# Altium schematic sheet Power.SchDoc
size A3
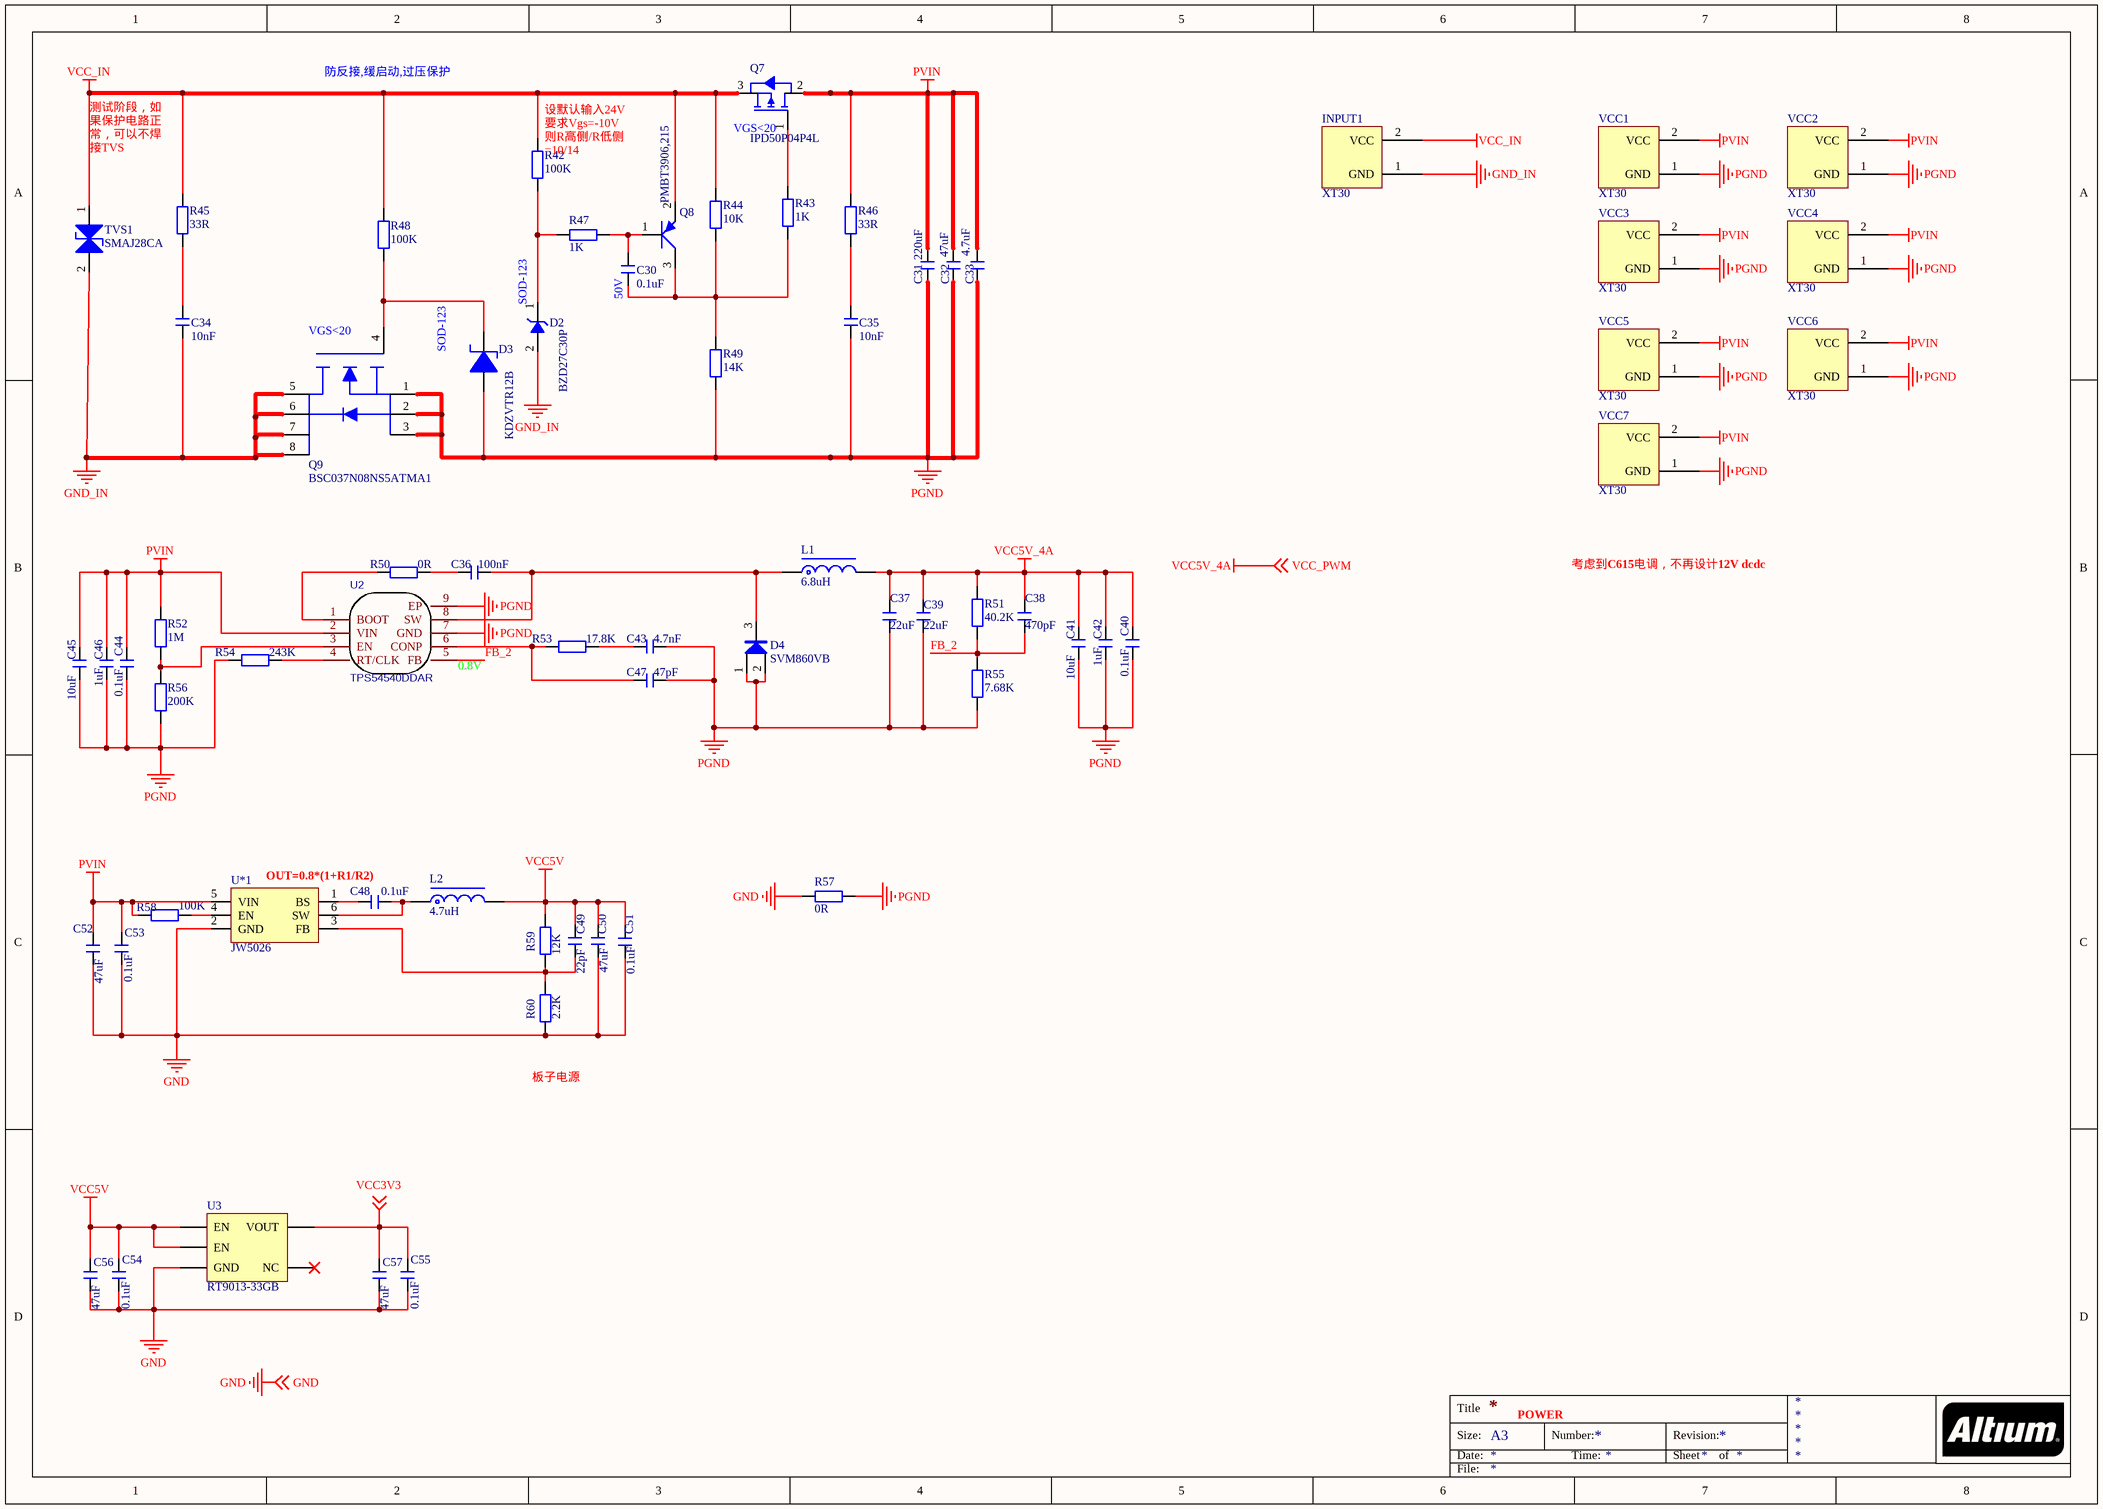
[diagram p0: Power.SchDoc]

## Parts
C30  0.1uF  [C 0603_L]
C31  220uF  [C 1206_L]
C32  47uF  [C 1206_L]
C33  4.7uF  [C 1206_L]
C34  10nF  [C 0603_L]
C35  10nF  [C 0603_L]
C36  100nF  [C 0603_L]
C37  22uF  [C 0805_L]
C38  470pF  [C 0603_L]
C39  22uF  [C 0805_L]
C40  0.1uF  [C 0805_L]
C41  10uF  [C 0805_L]
C42  1uF  [C 0805_L]
C43  4.7nF  [C 0603_L]
C44  0.1uF  [C 0805_L]
C45  10uF  [C 0805_L]
C46  1uF  [C 0805_L]
C47  47pF  [C 0603_L]
C48  0.1uF  [C 0603_L]
C49  22pF  [C 0603_L]
C50  47uF  [C 0805_L]
C51  0.1uF  [C 0805_L]
C52  47uF  [C 0805_L]
C53  0.1uF  [C 0805_L]
C54  0.1uF  [C 0805_L]
C55  0.1uF  [C 0805_L]
C56  47uF  [C 0805_L]
C57  47uF  [C 0805_L]
D2  BZD27C30P  [SOD-123_L2.8-W1.8-LS3.7-RD]
D3  KDZVTR12B  [SOD-123_L2.8-W1.8-LS3.7-RD]
D4  SVM860VB  [TO-277B_3P-L6.1-W4.3-LS7.0-BR]
INPUT1  XT30  [XT30PW-M]
L1  6.8uH  [CDRH73]
L2  4.7uH  [CD53]
Q7  IPD50P04P4L  [PG-TO252-3]
Q8  PMBT3906,215  [SOT-23-3_L2.9-W1.3-P1.90-LS2.4-BR]
Q9  BSC037N08NS5ATMA1  [PG-TDSON-8_L5.0-W6.0-P1.27-LS6.2-BL-EP]
R42  100K  [R 0603_L]
R43  1K  [R 0603_L]
R44  10K  [R 0603_L]
R45  33R  [R 0603_L]
R46  33R  [R 0603_L]
R47  1K  [R 0603_L]
R48  100K  [R 0603_L]
R49  14K  [R 0603_L]
R50  0R  [R 0603_L]
R51  40.2K  [R 0603_L]
R52  1M  [R 0603_L]
R53  17.8K  [R 0603_L]
R54  243K  [R 0603_L]
R55  7.68K  [R 0603_L]
R56  200K  [R 0603_L]
R57  0R  [R 0603_L]
R58  100K  [R 0603_L]
R59  12K  [R 0603_L]
R60  2.2K  [R 0603_L]
TVS1  SMAJ28CA  [SMA(DO-214AC)]
U2  TPS54540DDAR  [TPS54540]
U3  RT9013-33GB  [SOT23-5M]
U*1  JW5026  [SOT-23-6_L2.9-W1.6-P0.95-LS2.8-BL]
VCC1  XT30  [XT30UPB-F]
VCC2  XT30  [XT30UPB-F]
VCC3  XT30  [XT30UPB-F]
VCC4  XT30  [XT30UPB-F]
VCC5  XT30  [XT30UPB-F]
VCC6  XT30  [XT30UPB-F]
VCC7  XT30  [XT30UPB-F]

## Nets
GND: C50.1 C51.1 C52.1 C53.1 C54.1 C55.1 C56.1 C57.1 R57.1 R60.1 U3.2(GND) U*1.2(GND) ; off-sheet GND
GND_IN: C34.1 D2.2 INPUT1.1(GND) Q9.5 Q9.6 Q9.7 Q9.8 TVS1.2
PGND: C31.1 C32.1 C33.1 C35.1 C37.1 C39.1 C40.1 C41.1 C42.1 C43.2 C44.1 C45.1 C46.1 C47.2 D3.2 D4.1(A) D4.2(K) Q9.1 Q9.2 Q9.3 R49.1 R54.2 R55.1 R56.1 R57.2 U2.7(GND) U2.9(EP) VCC1.1(GND) VCC2.1(GND) VCC3.1(GND) VCC4.1(GND) VCC5.1(GND) VCC6.1(GND) VCC7.1(GND)
PVIN: C31.2 C32.2 C33.2 C44.2 C45.2 C46.2 C52.2 C53.2 Q7.2 R46.2 R52.2 R58.2 U2.2(VIN) U*1.5(VIN) VCC1.2(VCC) VCC2.2(VCC) VCC3.2(VCC) VCC4.2(VCC) VCC5.2(VCC) VCC6.2(VCC) VCC7.2(VCC)
VCC5V: C49.2 C50.2 C51.2 C54.2 C56.2 L2.2 R59.2 U3.1(EN) U3.3(EN)
VCC5V_4A: C37.2 C38.2 C39.2 C40.2 C41.2 C42.2 L1.2 R51.2 ; off-sheet VCC_PWM  [also labelled VCC_PWM]
VCC_IN: INPUT1.2(VCC) Q7.3 Q8.2 R42.2 R44.2 R45.2 R48.2 TVS1.1
FB_2: C38.1 R51.1 R55.2 U2.5(FB)
VCC3V3: C55.2 C57.2 U3.5(VOUT) ; off-sheet VCC3V3
NetC30_1: C30.1 Q8.3 R43.1 R44.1 R49.2
NetC30_2: C30.2 Q8.1 R47.1
NetC34_2: C34.2 R45.1
NetC35_2: C35.2 R46.1
NetC36_1: C36.1 R50.1
NetC36_2: C36.2 D4.3 L1.1 U2.8(SW)
NetC43_1: C43.1 R53.1
NetC47_1: C47.1 R53.2 U2.6(CONP)
NetC48_1: C48.1 U*1.1(BS)
NetC48_2: C48.2 L2.1 U*1.6(SW)
NetC49_1: C49.1 R59.1 R60.2 U*1.3(FB)
NetD2_1: D2.1 R42.1 R47.2
NetD3_1: D3.1 Q9.4 R48.1
NetQ7_1: Q7.1 R43.2
NetR50_2: R50.2 U2.1(BOOT)
NetR52_1: R52.1 R56.2 U2.3(EN)
NetR54_1: R54.1 U2.4(RT/CLK)
NetR58_1: R58.1 U*1.4(EN)

Not connected (* = marked no-connect by the designer): U3 4(NC)*

## Notes on the sheet
- 防反接,缓启动,过压保护
- 测试阶段，如果保护电路正常，可以不焊接TVS
- (near R42) 设默认输入24V
  要求Vgs=-10V
  则R高侧/R低侧=10/14
- (near Q7) VGS<20
- (near D2) SOD-123
- (near C30) 50V
- (near Q9) VGS<20
- SOD-123
- 考虑到C615电调，不再设计12V dcdc
- (near U2) 0.8V
- OUT=0.8*(1+R1/R2)
- (near R60) 板子电源
- POWER
- Title
- Size:
- Date:
- A3
- Number:
- Time:
- Revision:
- Sheet
- of
- File:

## Library data of the parts
C30-C57 = C: 贴片电容
D4 = SVM860VB: TO-277B系列,SVM860VB-8A
L1 = L-CDRH: 功率屏蔽电感
L2 = L-SMD: CD系列贴片线绕功率电感
R42-R60 = R: 贴片电阻
U2 = TPS54540DDAR: BOM_Manufacturer: TI; SMT Type: Extend; BOM_Supplier: LCSC; BOM_Manufacturer Part: TPS54540DDAR; BOM_Supplier Part: C95286; BOM_LCSC Assembly: Yes; spicePre: U
U*1 = JW5026 : BUCK、MAX40V